# Altium schematic sheet Sheet2.SchDoc
size A4; SheetNumber: 1; SheetTotal: 1
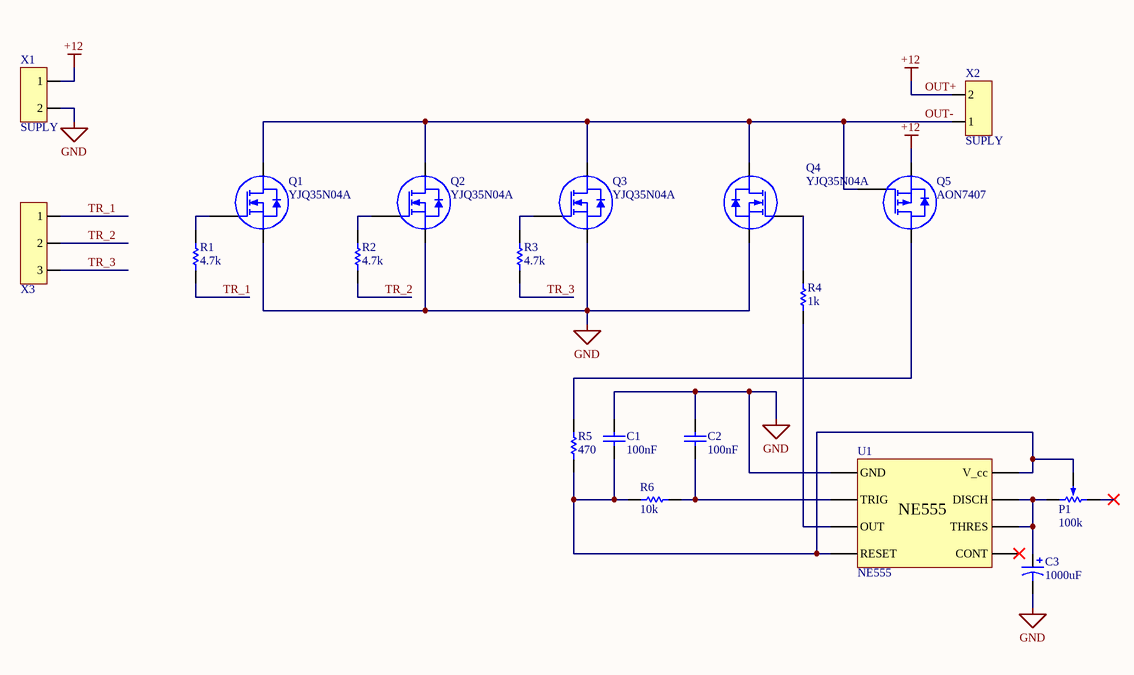
[diagram p0: Sheet2.SchDoc]

## Parts
C1  Capacitance: 100nF  [CAP_0603]  (hidden comment: Capacitor)
C2  Capacitance: 100nF  [CAP_0603]  (hidden comment: Capacitor)
C3  value 1000uF  [CAP_POL_12.5x20]  (hidden comment: Capacitor_Pol)
P1  Resistance: 100k  [3296w]  (hidden comment: Potentiometer)
Q1  YJQ35N04A  [DFN3.3x3.3]
Q2  YJQ35N04A  [DFN3.3x3.3]
Q3  YJQ35N04A  [DFN3.3x3.3]
Q4  YJQ35N04A  [DFN3.3x3.3]
Q5  AON7407  [DFN3x3]
R1  Resistance: 4.7k  [RES_0603]  (hidden comment: Resistor)
R2  Resistance: 4.7k  [RES_0603]  (hidden comment: Resistor)
R3  Resistance: 4.7k  [RES_0603]  (hidden comment: Resistor)
R4  Resistance: 1k  [RES_0603]  (hidden comment: Resistor)
R5  Resistance: 470  [RES_0603]  (hidden comment: Resistor)
R6  Resistance: 10k  [RES_0603]  (hidden comment: Resistor)
U1  NE555  [SO8]
X1  SUPLY  [SCREW_TERMINAL_X2 5mm]
X2  SUPLY  [SCREW_TERMINAL_X2 5mm]
X3  ?  [SCREW_TERMINAL_X3 5mm]  (value not drawn)

## Nets
GND: C1.1 C2.2 C3.2 Q1.1(S) Q2.1(S) Q3.1(S) Q4.1(S) U1.1(GND) X1.2
OUT+: Q5.1(S) X1.1 X2.2  [also labelled +12]
OUT-: Q1.5(D) Q2.5(D) Q3.5(D) Q4.5(D) Q5.4(G) X2.1
TR_1: R1.1 X3.1
TR_2: R2.1 X3.2
TR_3: R3.1 X3.3
NetC1_2: C1.2 P1.2 R5.1 R6.1 U1.4(RESET) U1.8(V_cc)
NetC2_1: C2.1 R6.2 U1.2(TRIG)
NetC3_1: C3.1 P1.1 U1.6(THRES) U1.7(DISCH)
NetQ1_4: Q1.4(G) R1.2
NetQ2_4: Q2.4(G) R2.2
NetQ3_4: Q3.4(G) R3.2
NetQ4_4: Q4.4(G) R4.1
NetQ5_5: Q5.5(D) R5.2
NetR4_2: R4.2 U1.3(OUT)

Not connected (* = marked no-connect by the designer): P1 3*; U1 5(CONT)*

## Library data of the parts
X1 X2 = Double connector
X3 = Tripple Connecotr